# Altium schematic sheet Atmega.SchDoc
size A4; SheetNumber: 2; SheetTotal: 4
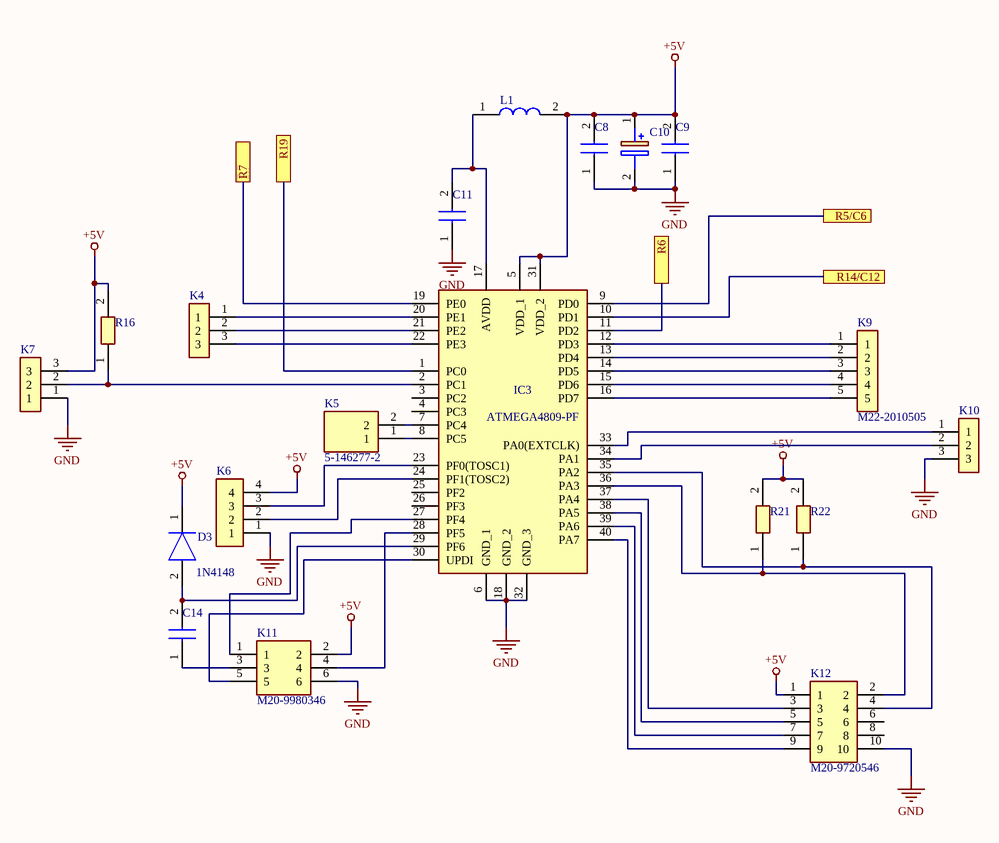
[diagram p0: Atmega.SchDoc]

## Parts
C8  (no value)  [CAPC2012X95N]
C9  (no value)  [CAPC2012X95N]
C10  10µ  [CAPPRD200W52D500H1250]  (value not drawn)
C11  (no value)  [CAPC2012X95N]
C14  (no value)  [CAPC2012X95N]
D3  1N4148  [1N4148WRHG]
IC3  ATMEGA4809-PF  [DIP1543W58P254L5175H635Q40N]
K4  09-65-2038  [SHDR3W160P0X396_1X3_1112X1062X1425P]  (value not drawn)
K5  5-146277-2  [HDRV2W67P0X254_1X2_467X234X823P]
K6  (no value)  [HDRV4W64P0X254_1X4_1016X254X864P]
K7  (no value)  [HDRV3W60P0X200_1X3_600X200X525P]
K9  M22-2010505  [HDRV5W50P0X200_1X5_1000X200X530P]
K10  (no value)  [HDRV3W60P0X200_1X3_600X200X525P]
K11  M20-9980346  [HDRV6W64P254_2X3_762X508X868P]
K12  M20-9720546  [HDRV10W64P254_2X5_1270X508X954P]
L1  FDSD0518-H-100M=P3  [FDSD0518H100MP3]  (value not drawn)
R16  (no value)  [RESC2012X90N]
R21  (no value)  [RESC2012X90N]
R22  (no value)  [RESC2012X90N]

## Ports
R5/C6, R6, R7, R14/C12, R19

## Nets
+5V: C8.2 C9.2 C10.1(+) D3.1(K) IC3.5(VDD_1) IC3.31(VDD_2) K6.4 K7.3 K11.2 K12.1 L1.2 R16.2 R21.2 R22.2
GND: C8.1 C9.1 C10.2(-) C11.1 IC3.6(GND_1) IC3.18(GND_2) IC3.32(GND_3) K6.1 K7.1 K10.3 K11.6 K12.10
R5/C6: IC3.9(PD0) ; port R5/C6
R6: IC3.11(PD2) ; port R6
R7: IC3.19(PE0) ; port R7
R14/C12: IC3.10(PD1) ; port R14/C12
R19: IC3.1(PC0) ; port R19
NetC11_2: C11.2 IC3.17(AVDD) L1.1
NetC14_1: C14.1 K11.3
NetC14_2: C14.2 D3.2(A) IC3.29(PF6)
NetIC3_2: IC3.2(PC1) K7.2 R16.1
NetIC3_7: IC3.7(PC4) K5.2
NetIC3_8: IC3.8(PC5) K5.1
NetIC3_12: IC3.12(PD3) K9.1
NetIC3_13: IC3.13(PD4) K9.2
NetIC3_14: IC3.14(PD5) K9.3
NetIC3_15: IC3.15(PD6) K9.4
NetIC3_16: IC3.16(PD7) K9.5
NetIC3_20: IC3.20(PE1) K4.1
NetIC3_21: IC3.21(PE2) K4.2
NetIC3_22: IC3.22(PE3) K4.3
NetIC3_23: IC3.23(PF0(TOSC1)) K6.3
NetIC3_24: IC3.24(PF1(TOSC2)) K6.2
NetIC3_27: IC3.27(PF4) K11.1
NetIC3_28: IC3.28(PF5) K11.4
NetIC3_30: IC3.30(UPDI) K11.5
NetIC3_33: IC3.33(PA0(EXTCLK)) K10.1
NetIC3_34: IC3.34(PA1) K10.2
NetIC3_35: IC3.35(PA2) K12.4 R22.1
NetIC3_36: IC3.36(PA3) K12.2 R21.1
NetIC3_37: IC3.37(PA4) K12.3
NetIC3_38: IC3.38(PA5) K12.5
NetIC3_39: IC3.39(PA6) K12.7
NetIC3_40: IC3.40(PA7) K12.9

Not connected (* = marked no-connect by the designer): IC3 3(PC2) 4(PC3) 25(PF2) 26(PF3); K12 6 8

## Library data of the parts
C8 C9 C11 C14 = CC0805KPX7R9BB104: Capacitor; Manufacturer_Name: KEMET; Datasheet Link: https://www.yageo.com/upload/media/product/productsearch/datasheet/mlcc/UPY-GPHC_X7R_6.3V-to-50V_20.pdf; Height: 0.95mm; Manufacturer_Part_Number: CC0805KPX7R9BB104
C10 = 860010672009: Capacitor Polarised; Manufacturer_Name: Wurth Elektronik; Datasheet Link: https://componentsearchengine.com/Datasheets/2/860010672009.pdf; Height: 12.5mm; Manufacturer_Part_Number: 860010672009; Mouser Part Number: 710-860010672009; Mouser Price/Stock: https://www.mouser.com/Search/Refine.aspx?Keyword=710-860010672009
D3 = 1N4148W_RHG: Diode; Manufacturer_Name: Taiwan Semiconductor; Manufacturer_Part_Number: 1N4148W RHG; Datasheet Link: https://mouser.componentsearchengine.com/Datasheets/1/1N4148W RHG.pdf; Height: 1.15mm; Mouser Part Number: 821-1N4148WRHG; Mouser Price/Stock: https://www.mouser.co.uk/ProductDetail/Taiwan-Semiconductor/1N4148W-RHG?qs=KwaGCOX4wIag2YPLXylAvA%3D%3D; Arrow Part Number: 1N4148W RHG; Arrow Price/Stock: https://www.arrow.com/en/products/1n4148wrhg/taiwan-semiconductor?region=nac
IC3 = ATMEGA4809-PF: Integrated Circuit; Manufacturer_Name: Microchip; Datasheet Link: http://ww1.microchip.com/downloads/en/DeviceDoc/40-pin-Data-Sheet-megaAVR-0-series-DS40002104A.pdf; Height: 6.35mm; Manufacturer_Part_Number: ATMEGA4809-PF; Mouser Part Number: 556-ATMEGA4809-PF; Mouser Price/Stock: https://www.mouser.co.uk/ProductDetail/Microchip-Technology-Atmel/ATMEGA4809-PF?qs=T3oQrply3y9UlpZbCygk%252BQ%3D%3D
K4 = 09-65-2038: Connector; Manufacturer_Name: Molex; Datasheet Link: https://www.molex.com/pdm_docs/sd/009652038_sd.pdf; Height: 14.25mm; Manufacturer_Part_Number: 09-65-2038; Mouser Part Number: 538-09-65-2038; Mouser Price/Stock: https://www.mouser.co.uk/ProductDetail/Molex/09-65-2038?qs=A%252B%2FNCR0PvNU%2FSwDn3lpSlg%3D%3D
K5 = 5-146277-2: Connector; Manufacturer_Name: TE Connectivity; Datasheet Link: https://componentsearchengine.com//5-146277-2.pdf; Height: 8.23mm; Mouser2 Part Number: 571-5-146277-2; Mouser2 Price/Stock: https://www.mouser.com/Search/Refine.aspx?Keyword=571-5-146277-2; Manufacturer_Part_Number: 5-146277-2
K6 = M20-9990445: Connector; Manufacturer_Name: Harwin; Datasheet Link: https://cdn.harwin.com/pdfs/M20-999.pdf; Height: 8.64mm; Manufacturer_Part_Number: M20-9990445
K7 K10 = M22-2010305: Connector; Manufacturer_Name: Harwin; Datasheet Link: https://componentsearchengine.com//M22-2010305.pdf; Height: 5.25mm; Mouser2 Part Number: 855-M22-2010305; Mouser2 Price/Stock: https://www.mouser.com/Search/Refine.aspx?Keyword=855-M22-2010305; Manufacturer_Part_Number: M22-2010305
K9 = M22-2010505: Connector; Manufacturer_Name: Harwin; Datasheet Link: https://datasheet.datasheetarchive.com/originals/distributors/Datasheets-20/DSA-391131.pdf; Height: 5.3mm; Manufacturer_Part_Number: M22-2010505
K11 = M20-9980346: Connector; Manufacturer_Name: Harwin; Datasheet Link: https://componentsearchengine.com//M20-9980346.pdf; Height: 8.68mm; Mouser2 Part Number: 855-M20-9980346; Mouser2 Price/Stock: https://www.mouser.com/Search/Refine.aspx?Keyword=855-M20-9980346; Manufacturer_Part_Number: M20-9980346
K12 = M20-9720546: Connector; Manufacturer_Name: Harwin; Datasheet Link: https://cdn.harwin.com/pdfs/M20-972.pdf; Height: 9.54mm; Manufacturer_Part_Number: M20-9720546
L1 = FDSD0518-H-100M=P3: Inductor; Manufacturer_Name: Murata Electronics; Datasheet Link: https://psearch.en.murata.com/inductor/product/FDSD0518-H-100M%23.html; Height: 1.8mm; Manufacturer_Part_Number: FDSD0518-H-100M=P3
R16 R21 R22 = CFN0805-JZ-R010ELF: Resistor; Manufacturer_Name: Bourns; Datasheet Link: https://www.bourns.com/docs/Product-Datasheets/CFN.pdf; Height: 0.9mm; Manufacturer_Part_Number: CFN0805-JZ-R010ELF